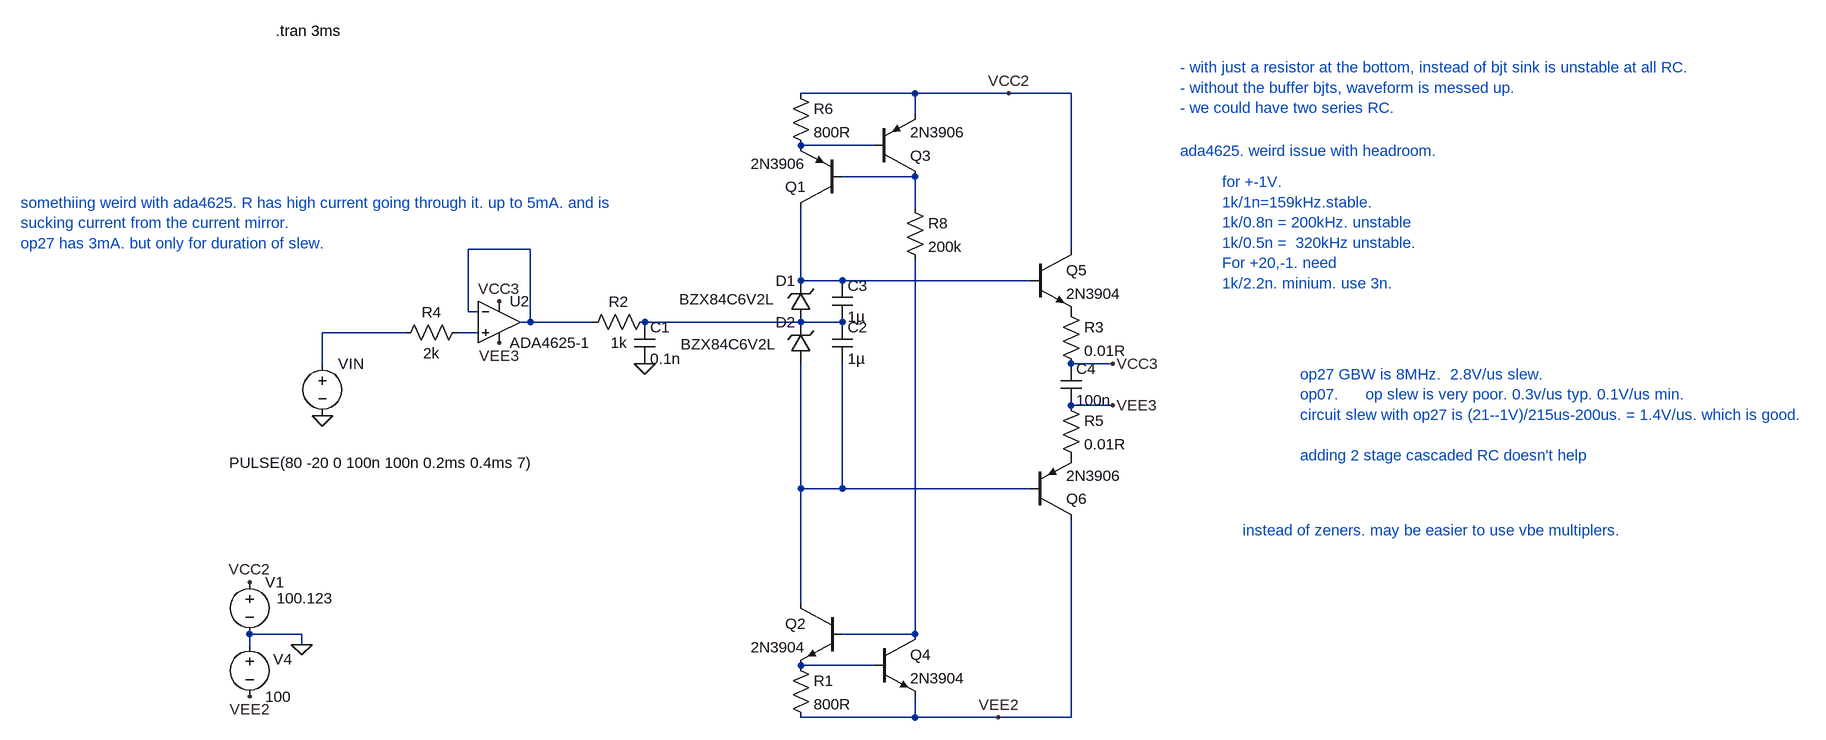
[diagram p0: schematic Draft52.asc]
Draft52.asc, the LTspice schematic file:
Version 4
SHEET 1 2336 896
WIRE 880 -192 704 -192
WIRE 1024 -192 880 -192
WIRE 1120 -192 1024 -192
WIRE 880 -160 880 -192
WIRE 816 -112 704 -112
WIRE 880 -64 768 -64
WIRE 880 -16 880 -64
WIRE 288 48 192 48
WIRE 1120 48 1120 -192
WIRE 704 96 704 -16
WIRE 768 96 704 96
WIRE 1056 96 768 96
WIRE 192 144 192 48
WIRE 208 144 192 144
WIRE 288 160 288 48
WIRE 288 160 272 160
WIRE 384 160 288 160
WIRE 704 160 464 160
WIRE 768 160 704 160
WIRE 96 176 -32 176
WIRE 208 176 176 176
WIRE -32 224 -32 176
WIRE 1184 224 1120 224
WIRE 1184 288 1120 288
WIRE 704 416 704 224
WIRE 768 416 768 224
WIRE 768 416 704 416
WIRE 1056 416 768 416
WIRE 704 592 704 416
WIRE -64 640 -144 640
WIRE 880 640 880 64
WIRE 880 640 768 640
WIRE -144 656 -144 640
WIRE -64 656 -64 640
WIRE 816 688 704 688
WIRE 880 768 880 736
WIRE 880 768 704 768
WIRE 1008 768 880 768
WIRE 1120 768 1120 464
WIRE 1120 768 1008 768
FLAG -32 304 0
FLAG -64 656 0
FLAG -144 560 VCC2
FLAG -144 736 VEE2
FLAG 1024 -192 VCC2
FLAG 1008 768 VEE2
FLAG 1184 224 VCC3
FLAG 1184 288 VEE3
FLAG 240 128 VCC3
FLAG 240 192 VEE3
FLAG 464 224 0
SYMBOL voltage -32 208 R0
WINDOW 123 0 0 Left 0
WINDOW 39 0 0 Left 0
WINDOW 3 -143 168 Left 2
SYMATTR Value PULSE(80 -20 0 100n 100n 0.2ms 0.4ms 7)
SYMATTR InstName VIN
SYMBOL res 192 160 R90
WINDOW 0 0 56 VBottom 2
WINDOW 3 32 56 VTop 2
SYMATTR InstName R4
SYMATTR Value 2k
SYMBOL pnp 768 -16 R180
SYMATTR InstName Q1
SYMATTR Value 2N3906
SYMBOL pnp 816 -64 M180
SYMATTR InstName Q3
SYMATTR Value 2N3906
SYMBOL res 688 -208 R0
SYMATTR InstName R6
SYMATTR Value 800R
SYMBOL voltage -144 544 R0
WINDOW 123 0 0 Left 0
WINDOW 39 0 0 Left 0
WINDOW 3 42 41 Left 2
SYMATTR Value 100.123
SYMATTR InstName V1
SYMBOL voltage -144 640 R0
WINDOW 123 0 0 Left 0
WINDOW 39 0 0 Left 0
WINDOW 0 36 39 Left 2
SYMATTR InstName V4
SYMATTR Value 100
SYMBOL res 864 -32 R0
SYMATTR InstName R8
SYMATTR Value 200k
SYMBOL zener 720 160 R180
WINDOW 0 24 64 Left 2
WINDOW 3 56 35 Left 2
SYMATTR InstName D1
SYMATTR Value BZX84C6V2L
SYMBOL zener 720 224 R180
WINDOW 0 24 64 Left 2
WINDOW 3 54 30 Left 2
SYMATTR InstName D2
SYMATTR Value BZX84C6V2L
SYMBOL npn 768 592 M0
SYMATTR InstName Q2
SYMATTR Value 2N3904
SYMBOL res 688 672 R0
SYMATTR InstName R1
SYMATTR Value 800R
SYMBOL npn 816 640 R0
SYMATTR InstName Q4
SYMATTR Value 2N3904
SYMBOL res 480 144 R90
WINDOW 0 0 56 VBottom 2
WINDOW 3 32 56 VTop 2
SYMATTR InstName R2
SYMATTR Value 1k
SYMBOL cap 448 160 R0
SYMATTR InstName C1
SYMATTR Value 0.1n
SYMBOL npn 1056 48 R0
SYMATTR InstName Q5
SYMATTR Value 2N3904
SYMBOL pnp 1056 464 M180
SYMATTR InstName Q6
SYMATTR Value 2N3906
SYMBOL res 1104 128 R0
SYMATTR InstName R3
SYMATTR Value 0.01R
SYMBOL res 1104 272 R0
SYMATTR InstName R5
SYMATTR Value 0.01R
SYMBOL cap 752 96 R0
SYMATTR InstName C3
SYMATTR Value 1µ
SYMBOL cap 752 160 R0
SYMATTR InstName C2
SYMATTR Value 1µ
SYMBOL cap 1104 224 R0
SYMATTR InstName C4
SYMATTR Value 100n
SYMBOL OpAmps\\ADA4625-1 240 96 R0
SYMATTR InstName U2
TEXT -104 -288 Left 2 !.tran 3ms
TEXT 1352 -56 Left 2 ;for +-1V. \n1k/1n=159kHz.stable.\n1k/0.8n = 200kHz. unstable\n1k/0.5n =  320kHz unstable.\nFor +20,-1. need\n1k/2.2n. minium. use 3n.
TEXT 1288 -232 Left 2 ;- with just a resistor at the bottom, instead of bjt sink is unstable at all RC.\n- without the buffer bjts, waveform is messed up.\n- we could have two series RC.
TEXT 1472 240 Left 2 ;op27 GBW is 8MHz.  2.8V/us slew.\nop07.      op slew is very poor. 0.3v/us typ. 0.1V/us min.\ncircuit slew with op27 is (21--1V)/215us-200us. = 1.4V/us. which is good.\n \nadding 2 stage cascaded RC doesn't help
TEXT 1288 -104 Left 2 ;ada4625. weird issue with headroom.
TEXT -496 -24 Left 2 ;somethiing weird with ada4625. R has high current going through it. up to 5mA. and is \nsucking current from the current mirror.\nop27 has 3mA. but only for duration of slew.
TEXT 1384 480 Left 2 ;instead of zeners. may be easier to use vbe multiplers.

The netlist it stands for:
* Draft52.asc
VIN N006 0 PULSE(80 -20 0 100n 100n 0.2ms 0.4ms 7)
R4 N007 N006 2k
Q1 N004 N002 N001 0 2N3906
Q3 N002 N001 VCC2 0 2N3906
R6 VCC2 N001 800R
V1 VCC2 0 100.123
V4 0 VEE2 100
R8 N002 N009 200k
D1 N005 N004 BZX84C6V2L
D2 N008 N005 BZX84C6V2L
Q2 N008 N009 N010 0 2N3904
R1 N010 VEE2 800R
Q4 N009 N010 VEE2 0 2N3904
R2 N005 N003 1k
C1 N005 0 0.1n
Q5 VCC2 N004 P001 0 2N3904
Q6 VEE2 N008 P002 0 2N3906
R3 P001 VCC3 0.01R
R5 VEE3 P002 0.01R
C3 N004 N005 1µ
C2 N005 N008 1µ
C4 VCC3 VEE3 100n
XU2 N007 N003 VCC3 VEE3 N003 ADA4625-1  ; pins In+ In- V+ V- OUT
.model D D
.lib standard.dio
.model NPN NPN
.model PNP PNP
.lib standard.bjt
.tran 3ms
* for +-1V.
* 1k/1n=159kHz.stable.
* 1k/0.8n = 200kHz. unstable
* 1k/0.5n =  320kHz unstable.
* For +20,-1. need
* 1k/2.2n. minium. use 3n.
* - with just a resistor at the bottom, instead of bjt sink is unstable at all RC.
* - without the buffer bjts, waveform is messed up.
* - we could have two series RC.
* op27 GBW is 8MHz.  2.8V/us slew.
* op07.      op slew is very poor. 0.3v/us typ. 0.1V/us min.
* circuit slew with op27 is (21--1V)/215us-200us. = 1.4V/us. which is good.
* adding 2 stage cascaded RC doesn't help
* ada4625. weird issue with headroom.
* somethiing weird with ada4625. R has high current going through it. up to 5mA. and is
* sucking current from the current mirror.
* op27 has 3mA. but only for duration of slew.
* instead of zeners. may be easier to use vbe multiplers.
.backanno
.end